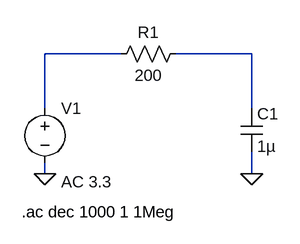
[diagram p0: schematic Filter_Simulation.asc]
Filter_Simulation.asc, the LTspice schematic file:
Version 4
SHEET 1 880 680
WIRE 176 48 64 48
WIRE 368 48 256 48
WIRE 64 128 64 48
WIRE 368 128 368 48
WIRE 64 224 64 208
WIRE 368 224 368 192
FLAG 368 224 0
FLAG 64 224 0
SYMBOL voltage 64 112 R0
WINDOW 123 24 124 Left 2
WINDOW 39 0 0 Left 0
SYMATTR InstName V1
SYMATTR Value ""
SYMATTR Value2 AC 3.3
SYMBOL res 272 32 R90
WINDOW 0 0 56 VBottom 2
WINDOW 3 32 56 VTop 2
SYMATTR InstName R1
SYMATTR Value 200
SYMBOL cap 352 128 R0
SYMATTR InstName C1
SYMATTR Value 1µ
TEXT 30 280 Left 2 !.ac dec 1000 1 1Meg

The netlist it stands for:
* Filter_Simulation.asc
V1 N001 0 AC 3.3
R1 N002 N001 200
C1 N002 0 1µ
.ac dec 1000 1 1Meg
.backanno
.end